# Altium schematic sheet IPMI.SchDoc
size A4; DocumentNumber: 5; SheetNumber: 5; SheetTotal: 30
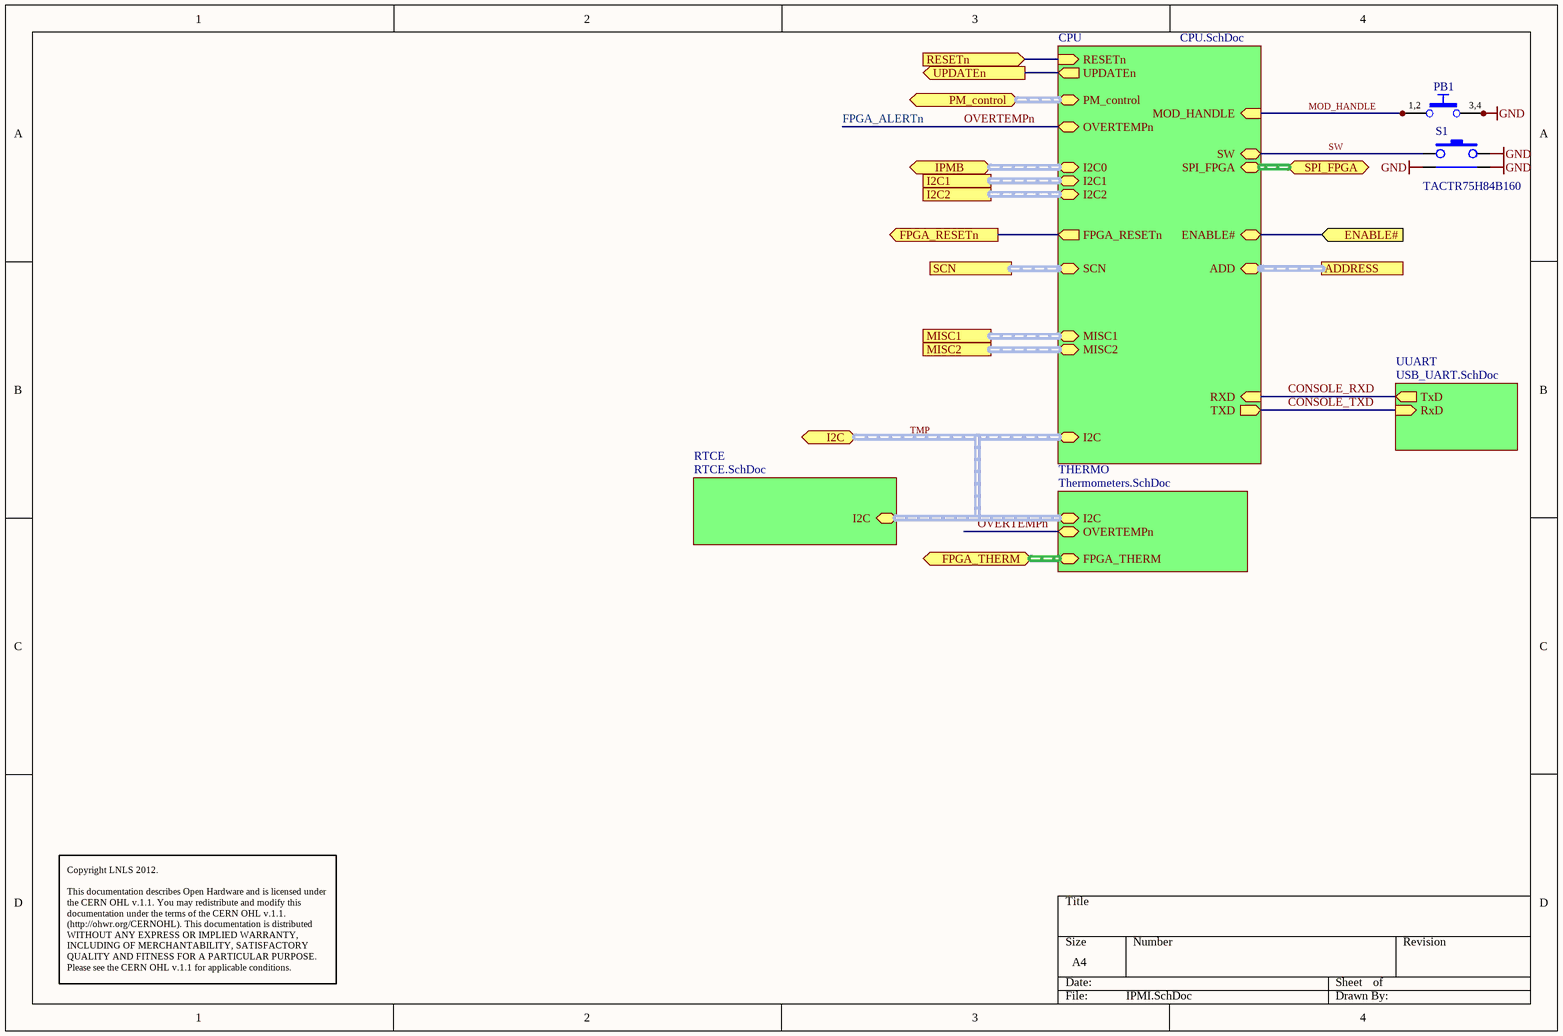
[diagram p0: IPMI.SchDoc]

## Parts
PB1  Push Button  [SW_C&K_HDT0001]  (value not drawn)
S1  TACTR75H84B160  [PB_ALPS_SKHHLQA010]

## Sub-sheets
CPU = CPU.SchDoc: ENABLE#, PM_control (harness PM_control), OVERTEMPn (bidir), MOD_HANDLE (in), SPI_FPGA (harness SPI), SW, RXD (in), TXD (out), RESETn (in), UPDATEn (out), I2C (harness I2C), I2C0 (harness I2C), I2C1 (harness I2C), I2C2 (harness I2C), MISC1 (harness MISC), MISC2 (harness MISC), ADD (harness AMC_ADD), SCN (harness SCN), FPGA_RESETn (out)
RTCE = RTCE.SchDoc: I2C (harness I2C)
THERMO = Thermometers.SchDoc: OVERTEMPn (bidir), FPGA_THERM (harness FPGA_THERM), I2C (harness I2C)
UUART = USB_UART.SchDoc: TxD (out), RxD (in)

## Ports
ADDRESS (harness AMC_ADD), ENABLE# (in), FPGA_RESETn (out), FPGA_THERM (harness FPGA_THERM), I2C1 (harness I2C), I2C2 (harness I2C), I2C (harness I2C), IPMB (harness I2C), MISC1 (harness MISC), MISC2 (harness MISC), PM_control (harness PM_control), RESETn (in), SCN (harness SCN), SPI_FPGA (harness SPI), UPDATEn (out)

## Nets
GND: PB1.3 PB1.4 S1.2 S1.3 S1.4
CONSOLE_RXD: sheet CPU/RXD, sheet UUART/TxD
CONSOLE_TXD: sheet CPU/TXD, sheet UUART/RxD
ENABLE#: port ENABLE#, sheet CPU/ENABLE#
FPGA_ALERTn: sheet CPU/OVERTEMPn, sheet THERMO/OVERTEMPn  [also labelled OVERTEMPn]
FPGA_RESETn: port FPGA_RESETn, sheet CPU/FPGA_RESETn
MOD_HANDLE: PB1.1 PB1.2 ; sheet CPU/MOD_HANDLE
RESETn: port RESETn, sheet CPU/RESETn
SW: S1.1 ; sheet CPU/SW
UPDATEn: port UPDATEn, sheet CPU/UPDATEn

## Buses and harness runs
harness port ADDRESS = sheet CPU/ADD
harness port FPGA_THERM = sheet THERMO/FPGA_THERM
harness port I2C1 = sheet CPU/I2C1
harness port I2C2 = sheet CPU/I2C2
harness port IPMB = sheet CPU/I2C0
harness port MISC1 = sheet CPU/MISC1
harness port MISC2 = sheet CPU/MISC2
harness port PM_control = sheet CPU/PM_control
harness port SCN = sheet CPU/SCN
harness port SPI_FPGA = sheet CPU/SPI_FPGA
harness TMP = port I2C = sheet CPU/I2C = sheet RTCE/I2C = sheet THERMO/I2C

## Notes on the sheet
- Copyright LNLS 2012.
  This documentation describes Open Hardware and is licensed under the CERN OHL v.1.1. You may redistribute and modify this documentation under the terms of the CERN OHL v.1.1. (http://ohwr.org/CERNOHL). This documentation is distributed WITHOUT ANY EXPRESS OR IMPLIED WARRANTY, INCLUDING OF MERCHANTABILITY, SATISFACTORY QUALITY AND FITNESS FOR A PARTICULAR PURPOSE. Please see the CERN OHL v.1.1 for applicable conditions.
- (in symbol SW_C&K_HDT0001) 1,2; 3,4

## Library data of the parts
PB1 = SW_C&K_HDT0001: Push-Button Switch SPDT; Part Description: 5VDC 1mA SPST-NO Micro Mini Surface Surface Mount Detect Push-Button Switch, HDT Serie; Manufacturer: C&K; Table: Switches; Part Number: SW_C&K_HDT0001; Component Kind: Standard; Component Type: Standard; Pin Count: 4; PackageDescription: Body 3.5x2.8mm, Micro Mini Surface Mount Detect Switches, HDT Serie; Family: Push Button; Mounted: Yes; Socket: No; SMD: Yes; Status: None; Manufacturer Part Number: HDT0001; ComponentHeight: 3.35mm; HelpURL: \\cern.ch\dfs\Applications\Altium\Datasheets\SW_C&K_HDT0001.pdf; Author: CERN DEM JLC; CreateDate: 2012-08-15; LatestRevisionDate: 2012-08-15
S1 = SW-PB_RA_5.8mm: Push button